# EAGLE schematic PowerMonitor (EAGLE 7.3.0)
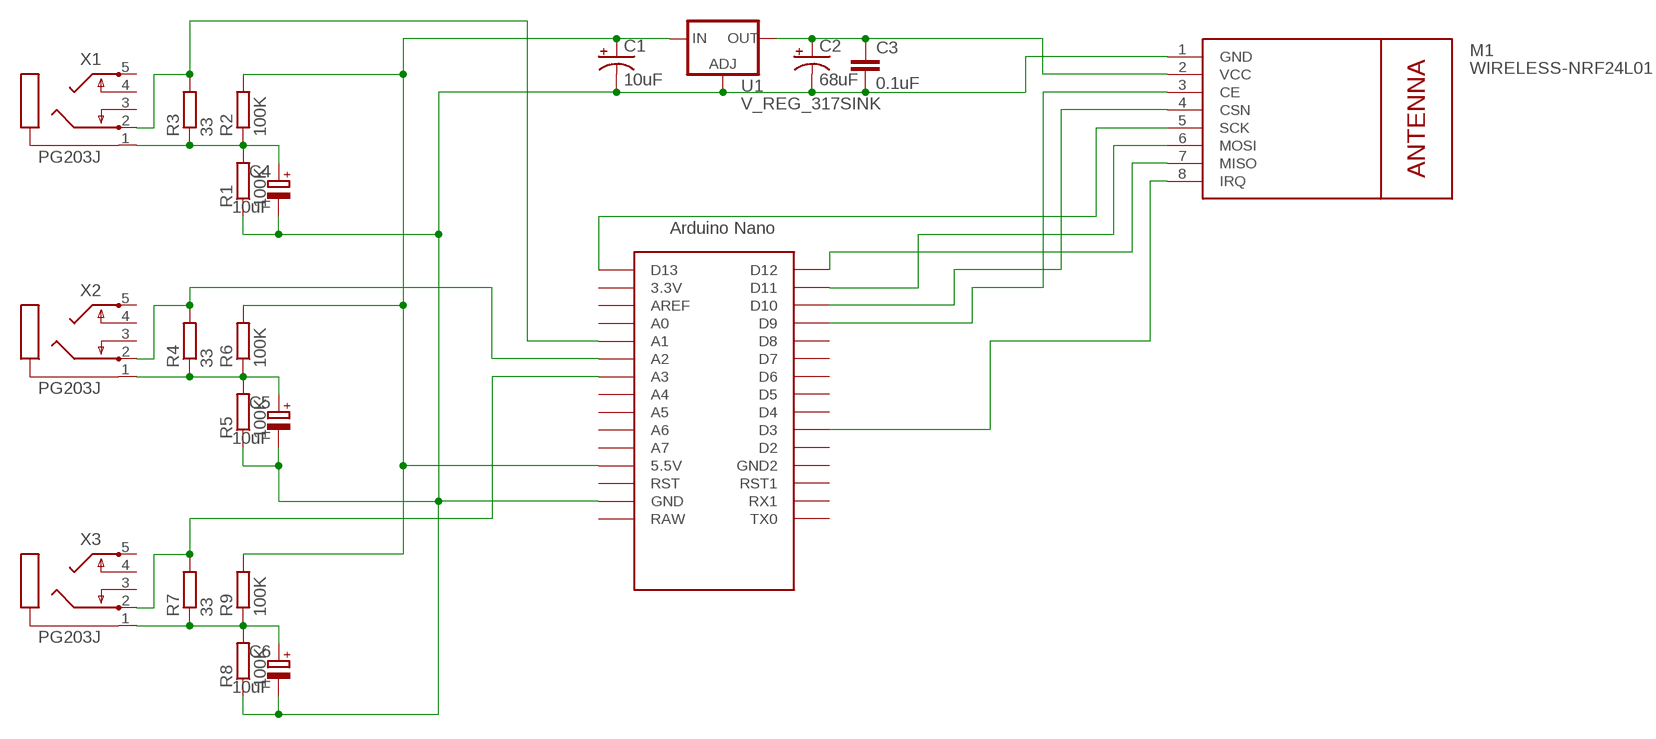
[diagram p0: schematic, sheet 1]

## Parts
C1  10uF  CAP_POL1206  [EIA3216]
C2  68uF  CAP_POL1206  [EIA3216]
C3  0.1uF  CAPEZ  [CAP-PTH-SMALLEZ]
C4  10uF  CPOL-EUC  [PANASONIC_C]
C5  10uF  CPOL-EUC  [PANASONIC_C]
C6  10uF  CPOL-EUC  [PANASONIC_C]
M1  WIRELESS-NRF24L01  [WIRELESS-NRF24L01]
R1  100K  R-EU_M0805  [M0805]
R2  100K  R-EU_M0805  [M0805]
R3  33  R-EU_M0805  [M0805]
R4  33  R-EU_M0805  [M0805]
R5  100K  R-EU_M0805  [M0805]
R6  100K  R-EU_M0805  [M0805]
R7  33  R-EU_M0805  [M0805]
R8  100K  R-EU_M0805  [M0805]
R9  100K  R-EU_M0805  [M0805]
U1  V_REG_317SINK  [TO220-ADJ]
U$1  NANO  [NANO]
X1  PG203J  [PG203J]
X2  PG203J  [PG203J]
X3  PG203J  [PG203J]

## Nets
N$2: C1.A(+) R2.2 R6.2 R9.2 U1.IN U$1.5V(5.5V)
N$4: C4.+ R1.2 R2.1 R3.1 X1.1
N$5: C2.A(+) C3.1 M1.2(VCC) U1.OUT
N$6: M1.3(CE) U$1.D9
N$7: M1.4(CSN) U$1.D10
N$8: M1.7(MISO) U$1.D12
N$9: M1.6(MOSI) U$1.D11
N$10: M1.5(SCK) U$1.D13
N$11: R3.2 U$1.A1 X1.2
N$13: M1.8(IRQ) U$1.D3
N$14: C5.+ R4.1 R5.2 R6.1 X2.1
N$15: R4.2 U$1.A2 X2.2
N$16: C1.C(-) C2.C(-) C3.2 C4.- C5.- C6.- M1.1(GND) R1.1 R5.1 R8.1 U1.ADJ U$1.GND
N$17: C6.+ R7.1 R8.2 R9.1 X3.1
N$18: R7.2 U$1.A3 X3.2
Unconnected: U$1.3.3V U$1.A0 U$1.A4 U$1.A5 U$1.A6 U$1.A7 U$1.AREF U$1.D2 U$1.D4 U$1.D5 U$1.D6 U$1.D7 U$1.D8 U$1.GND1(GND2) U$1.ICSP1 U$1.ICSP2 U$1.ICSP3 U$1.ICSP4 U$1.ICSP5 U$1.ICSP6 U$1.RAW U$1.RST U$1.RST1 U$1.RX1 U$1.TX0 X1.3 X1.4 X1.5 X2.3 X2.4 X2.5 X3.3 X3.4 X3.5

## Library data of the parts
C1 C2 = SparkFun-Passives:CAP_POL: Capacitor Polarized These are standard SMD and PTH capacitors. Normally 10uF, 47uF, and 100uF in electrolytic and tantalum varieties. Always verify the external diameter of the through hole cap, it varies with capacity, voltage, and manufacturer. The EIA devices should be standard.
C3 = SparkFun-Passives:CAP: Capacitor Standard 0603 ceramic capacitor, and 0.1" leaded capacitor.
C4-C6 = resistor:CPOL-EU: POLARIZED CAPACITOR, European symbol
M1 = diy-modules:WIRELESS-NRF24L01: 2.4 GHz Wireless Module based on NRF24L01 chip
R1-R9 = rcl:R-EU_: RESISTOR, European symbol
U1 = SparkFun-PowerIC:V_REG_317: Voltage Regulator Standard LM317 adjustable voltage regulator. AOI (Adjust Output Input). Google 'LM317 Calculator' for easy to use app to get the two resistor values needed. 240/720 for 5V output. 240/390 for 3.3V output. Spark Fun Electronics SKU : COM-00527
U$1 = Arduino-clone:NANO: Arduino Nano
X1-X3 = con-hirschmann:PG203J: MIC/HEADPHONE JACK KS-S stereo microphone/headphone jack PG203JN (Schukat); OC_FARNELL: unknown; OC_NEWARK: unknown